# Altium schematic sheet TOP.SchDoc
size A3; SheetNumber: 1; SheetTotal: 9
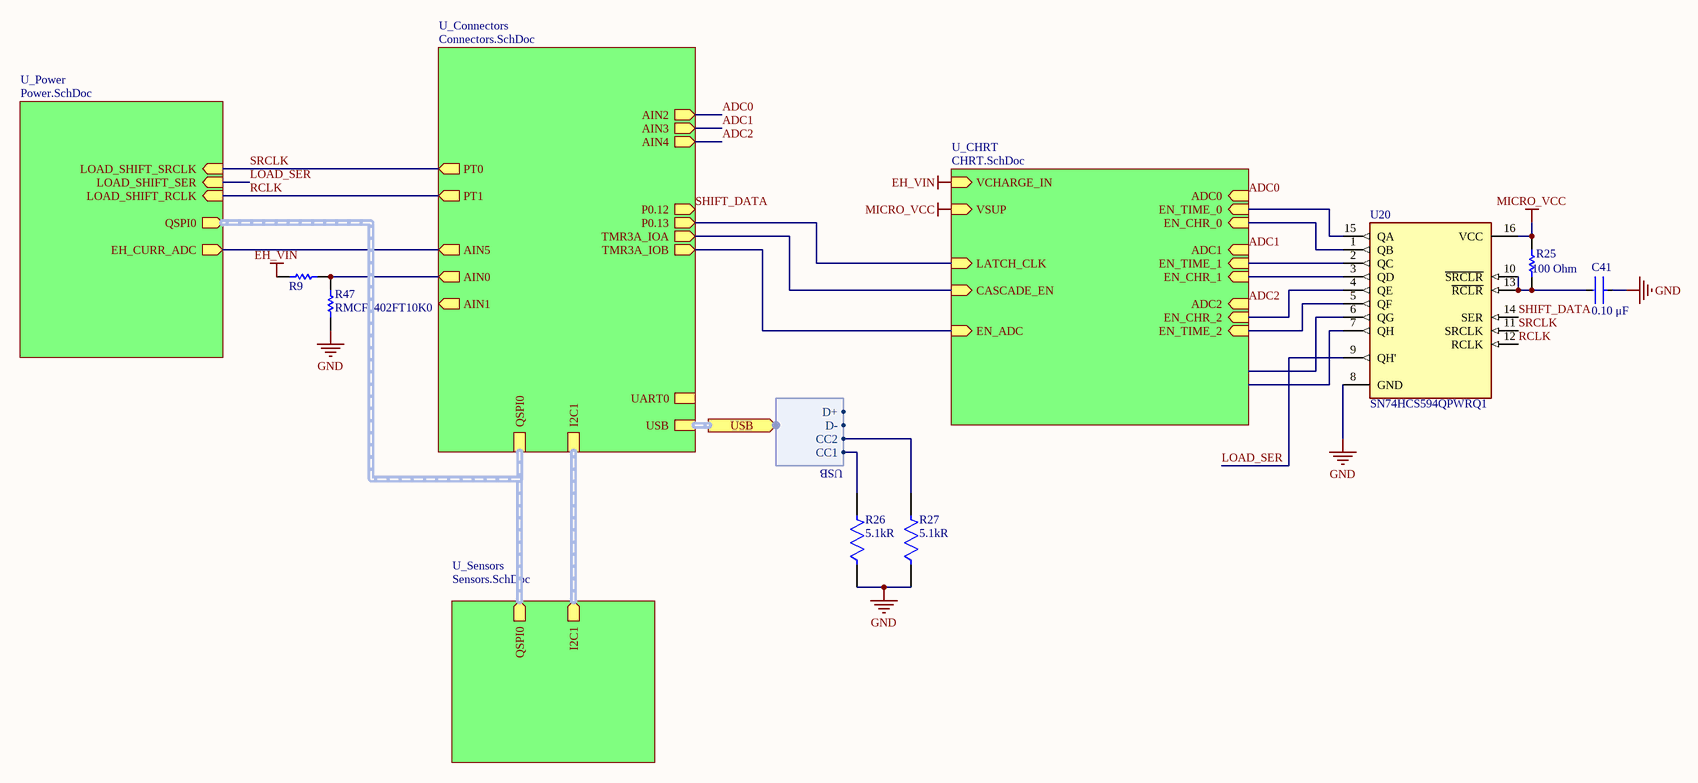
[diagram p0: TOP.SchDoc]

## Parts
C41  Capacitance: 0.10 μF  [FP-C0402-BB-MFG]  (hidden comment: C0402C104K8PACTU)
R9  RC0402JR-075M6L  [RESC1005X40X25ML05T10]  (value not drawn)
R25  Resistance: 100 Ohm  [RESC1005X40X25LL05T05]  (hidden comment: ERJ-2RKF1000X)
R26  Resistance: 5.1kR  [FP-CRCW0402-e3-IPC_A]  (hidden comment: CRCW04025K10FKED)
R27  Resistance: 5.1kR  [FP-CRCW0402-e3-IPC_A]  (hidden comment: CRCW04025K10FKED)
R47  RMCF0402FT10K0  [RESC1005X40X25ML05T10]
U20  SN74HCS594QPWRQ1  [FP-PW0016A-IPC_A]

## Sub-sheets
U_CHRT = CHRT.SchDoc: VCHARGE_IN (in), VSUP (in), LATCH_CLK (in), CASCADE_EN (in), EN_ADC (in), ADC1 (in), EN_TIME_0 (in), ADC0 (in), EN_CHR_1 (in), EN_CHR_0 (in), EN_CHR_2 (in), EN_TIME_2 (in), EN_TIME_1 (in), ADC2 (in)
U_Connectors = Connectors.SchDoc: I2C1 (harness I2C1), QSPI0 (harness QSPI0), AIN2 (out), AIN3 (out), AIN4 (out), AIN5 (out), TMR3A_IOA (out), TMR3A_IOB (out), PT0 (out), PT1 (out), P0.12 (out), P0.13 (out), UART0 (harness *), USB (harness USB), AIN0 (out), AIN1 (out)
U_Power = Power.SchDoc: LOAD_SHIFT_SRCLK (in), LOAD_SHIFT_SER (in), LOAD_SHIFT_RCLK (in), QSPI0 (out, harness QSPI0), EH_CURR_ADC (out)
U_Sensors = Sensors.SchDoc: I2C1 (out, harness I2C1), QSPI0 (out, harness QSPI0)

## Ports
USB (out, harness USB)

## Harnesses
USB: CC1, CC2, D+, D-

## Nets
EH_VIN: R9.1 ; sheet U_CHRT/VCHARGE_IN
GND: C41.1 R26.1 R27.1 R47.1 U20.8(GND)
MICRO_VCC: R25.2 U20.16(VCC) ; sheet U_CHRT/VSUP
ADC0: sheet U_Connectors/AIN2, sheet U_CHRT/ADC0
ADC1: sheet U_Connectors/AIN3, sheet U_CHRT/ADC1
ADC2: sheet U_Connectors/AIN4, sheet U_CHRT/ADC2
LOAD_SER: U20.9(QH') ; sheet U_Power/LOAD_SHIFT_SER
RCLK: U20.12(RCLK) ; sheet U_Power/LOAD_SHIFT_RCLK, sheet U_Connectors/PT1
SHIFT_DATA: U20.14(SER) ; sheet U_Connectors/P0.12
SRCLK: U20.11(SRCLK) ; sheet U_Power/LOAD_SHIFT_SRCLK, sheet U_Connectors/PT0
NetC41_2: C41.2 R25.1 U20.10(~{SRCLR}) U20.13(~{RCLR})
NetR9_2: R9.2 R47.2 ; sheet U_Connectors/AIN0
NetR26_2: R26.2 ; port USB.CC1
NetR27_2: R27.2 ; port USB.CC2
NetU20_1: U20.1(QB) ; sheet U_CHRT/EN_CHR_0
NetU20_2: U20.2(QC) ; sheet U_CHRT/EN_TIME_1
NetU20_3: U20.3(QD) ; sheet U_CHRT/EN_CHR_1
NetU20_4: U20.4(QE) ; sheet U_CHRT/EN_CHR_2
NetU20_5: U20.5(QF) ; sheet U_CHRT/EN_TIME_2
NetU20_15: U20.15(QA) ; sheet U_CHRT/EN_TIME_0
(unnamed): sheet U_Power/EH_CURR_ADC, sheet U_Connectors/AIN5
(unnamed): sheet U_Connectors/TMR3A_IOA, sheet U_CHRT/CASCADE_EN
(unnamed): sheet U_Connectors/TMR3A_IOB, sheet U_CHRT/EN_ADC
(unnamed): sheet U_Connectors/P0.13, sheet U_CHRT/LATCH_CLK

Not connected (* = marked no-connect by the designer): U20 6(QG) 7(QH)

## Buses and harness runs
harness port USB = sheet U_Connectors/USB
harness sheet U_Connectors/I2C1 = sheet U_Sensors/I2C1
harness sheet U_Connectors/QSPI0 = sheet U_Power/QSPI0 = sheet U_Sensors/QSPI0

## Library data of the parts
C41 = CMP-2008-02046-2: CAP CER 0.1UF 10V X5R 0402; Manufacturer: Kemet; Material: Ceramic; Temperature Coefficient: 15%; Tolerance: 0.1; Value: 0.10 μF; Package: C0402-BB; Temperature: -55°C to +125°C; ComponentLink2Description: Datasheet; Temperature Characteristic: X5R; Device Class L1: Passive Components; Height: 0.55mm; Lead Free: Yes; ComponentLink2URL: https://content.kemet.com/datasheets/KEM_C1002_X7R_SMD.pdf; Device Class L2: Capacitors; Temperature Range Low: -55°C; Temperature Range High: +125°C; RoHS: TRUE; Octopart: https://octopart.com/c0402c104k8pactu-kemet-140039; Automotive: No; Mouser Description: Capacitor 100 nF 10 VDC 0402; Category: Cap; Voltage Rating: 10 V; Digikey Description: CAP CER 0.1UF 10V X5R 0402; Ipc Land Pattern Name: CAPC10050X50; Device Class L3: Ceramic Capacitors; Manufacturer Part Number: C0402C104K8PACTU
R9 = CMP-2002-07139-1: Manufacturer: Yageo / Phycomp; Part Number: RC0402JR-075M6L
R25 = CMP-2002-00605-3: Chip Resistor, 100 Ohm, +/- 1%, 100 mW, -55 to 155 degC, 0402 (1005 Metric), RoHS, Tape and Reel; Manufacturer: Basic Passives; Power Rating: 100 mW; Voltage Rating: 50 V; Case\/Package: 0402; Width: 0.5 mm; Pins: 2; ComponentLink2Description: Datasheet; PackageReference: 0402; Height: 0.35 mm; Tolerance: 1%; DatasheetVersion: 04/2015; Case Code (Imperial): 0402; Min Operating Temperature: -55 degC; Radiation Hardening: No; Length: 1 mm; Package Quantity: 10000; PackageDescription: 2-Pin Surface Mount Device, Body 1 x 0.5 mm; Mounting Technology: Surface Mount; Case Code (Metric): 1005; Packaging: Tape and Reel; ComponentLink1URL: http://www.panasonic.com/; RoHSCompliant: true; Max Operating Temperature: 155 degC; REACH SVHC: Yes; PartNumber: ERJ-2RKF1000X; ComponentLink1Description: Manufacturer URL; ComponentLink2URL: http://industrial.panasonic.com/cdbs/www-data/pdf/RDA0000/AOA0000C86.pdf; Mount: Surface Mount
R26 R27 = CMP-1011-00590-4: RES Thick Film, 5.1kΩ, 1%, 0.063W, 100ppm/°C, 0402; Voltage Rating: 50V; Max Power Dissipation: 63mW; Case/Package: 0402; Min Operating Temperature: -55°C; Height: 0.35mm; Contact Plating: Tin; Tolerance: 1%; Max Operating Temperature: 155°C; Lead Free: Lead Free; Number of Terminations: 2; Temperature Coefficient: 100ppm/°C; Weight: 2.3E-05oz; Termination: SMD/SMT; Radiation Hardening: No; Voltage Rating (DC): 50V; Length: 1mm; Features: Automotive AEC-Q200; Case Code (Metric): 1005; Width: 0.02inch; Package Quantity: 10; Military Standard: Not; Depth: 0.5mm; Packaging: Tape and Reel; Power Rating: 63mW; Case Code (Imperial): 0402; Composition: Thick Film
R47 = CMP-2002-07490-1: Manufacturer: Yageo / Phycomp; Part Number: RC0402FR-071ML
U20 = CMP-04904-000006-1: AUTOMOTIVE 8-BIT SHIFT REGISTERS